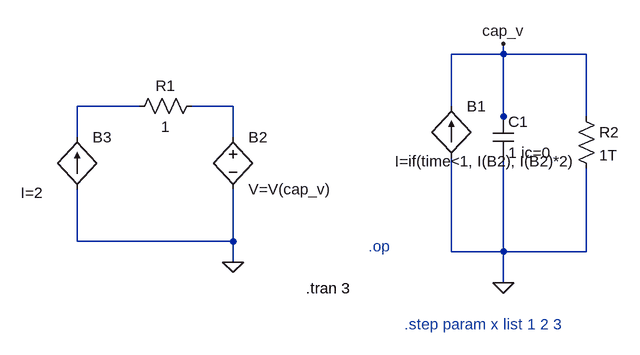
[diagram p0: schematic test_variable_cap_cont_voltage.asc]
test_variable_cap_cont_voltage.asc, the LTspice schematic file:
Version 4
SHEET 1 1060 680
WIRE 432 208 432 192
WIRE 432 208 352 208
WIRE 560 208 432 208
WIRE -128 288 -224 288
WIRE 16 288 -48 288
WIRE 352 288 352 208
WIRE 432 304 432 208
WIRE 560 304 560 208
WIRE 432 320 432 304
WIRE -224 336 -224 288
WIRE 16 336 16 288
WIRE -224 496 -224 416
WIRE 16 496 16 416
WIRE 16 496 -224 496
WIRE 352 512 352 368
WIRE 432 512 432 368
WIRE 432 512 352 512
WIRE 560 512 560 384
WIRE 560 512 432 512
WIRE 16 528 16 496
WIRE 432 560 432 512
FLAG 432 560 0
FLAG 16 528 0
FLAG 432 192 cap_v
SYMBOL cap 416 304 R0
SYMATTR InstName C1
SYMATTR Value 1 ic=0
SYMBOL bi2 352 288 R0
WINDOW 3 -87 85 Left 2
SYMATTR InstName B1
SYMATTR Value I=if(time<1, I(B2), I(B2)*2)
SYMBOL bv 16 320 R0
SYMATTR InstName B2
SYMATTR Value V=V(cap_v)
SYMBOL res -32 272 R90
WINDOW 0 0 56 VBottom 2
WINDOW 3 32 56 VTop 2
SYMATTR InstName R1
SYMATTR Value 1
SYMBOL res 544 288 R0
SYMATTR InstName R2
SYMATTR Value 1T
SYMBOL bi2 -224 336 R0
WINDOW 3 -87 85 Left 2
SYMATTR InstName B3
SYMATTR Value I=2
TEXT 128 568 Left 2 !.tran 3
TEXT 280 624 Left 2 ;.step param x list 1 2 3
TEXT 224 504 Left 2 ;.op

The netlist it stands for:
* test_variable_cap_cont_voltage.asc
C1 cap_v 0 1 ic=0
B1 0 cap_v I=if(time<1, I(B2), I(B2)*2)
B2 N002 0 V=V(cap_v)
R1 N002 N001 1
R2 cap_v 0 1T
B3 0 N001 I=2
.tran 3
* .step param x list 1 2 3
* .op
.backanno
.end